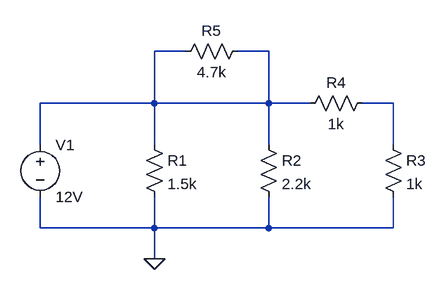
[diagram p0: schematic Schema1.asc]
Schema1.asc, the LTspice schematic file:
Version 4
SHEET 1 880 680
WIRE 224 16 176 16
WIRE 352 16 304 16
WIRE 176 96 176 16
WIRE 176 96 0 96
WIRE 352 96 352 16
WIRE 352 96 176 96
WIRE 416 96 352 96
WIRE 544 96 496 96
WIRE 0 160 0 96
WIRE 176 160 176 96
WIRE 352 160 352 96
WIRE 544 160 544 96
WIRE 0 288 0 240
WIRE 176 288 176 240
WIRE 176 288 0 288
WIRE 352 288 352 240
WIRE 352 288 176 288
WIRE 544 288 544 240
WIRE 544 288 352 288
WIRE 176 336 176 288
FLAG 176 336 0
SYMBOL voltage 0 144 R0
WINDOW 123 0 0 Left 0
WINDOW 39 0 0 Left 0
SYMATTR InstName V1
SYMATTR Value 12V
SYMBOL res 160 144 R0
SYMATTR InstName R1
SYMATTR Value 1.5k
SYMBOL res 336 144 R0
SYMATTR InstName R2
SYMATTR Value 2.2k
SYMBOL res 528 144 R0
SYMATTR InstName R3
SYMATTR Value 1k
SYMBOL res 512 80 R90
WINDOW 0 0 56 VBottom 2
WINDOW 3 32 56 VTop 2
SYMATTR InstName R4
SYMATTR Value 1k
SYMBOL res 320 0 R90
WINDOW 0 0 56 VBottom 2
WINDOW 3 32 56 VTop 2
SYMATTR InstName R5
SYMATTR Value 4.7k

The netlist it stands for:
* Schema1.asc
V1 N001 0 12V
R1 N001 0 1.5k
R2 N001 0 2.2k
R3 N002 0 1k
R4 N002 N001 1k
R5 N001 N001 4.7k
.backanno
.end